# Altium schematic sheet 1_POWER.schdoc
size 302 x 215 mm; Symbol: Sheet_A4; Device: Sheet_A4; @Project Name: Yuzuki Chameleon 基于H616的卡片电脑; REV: 1.0; Date: 2021-09-08; Sheet: 1/1; Draw By: GloomyGhost; Company: YuzukiHD; Version: 1.0; @Page No: 1; @Page Count: 4; @Update Date: 2025-03-02; SheetNumber: 1; SheetTotal: 4
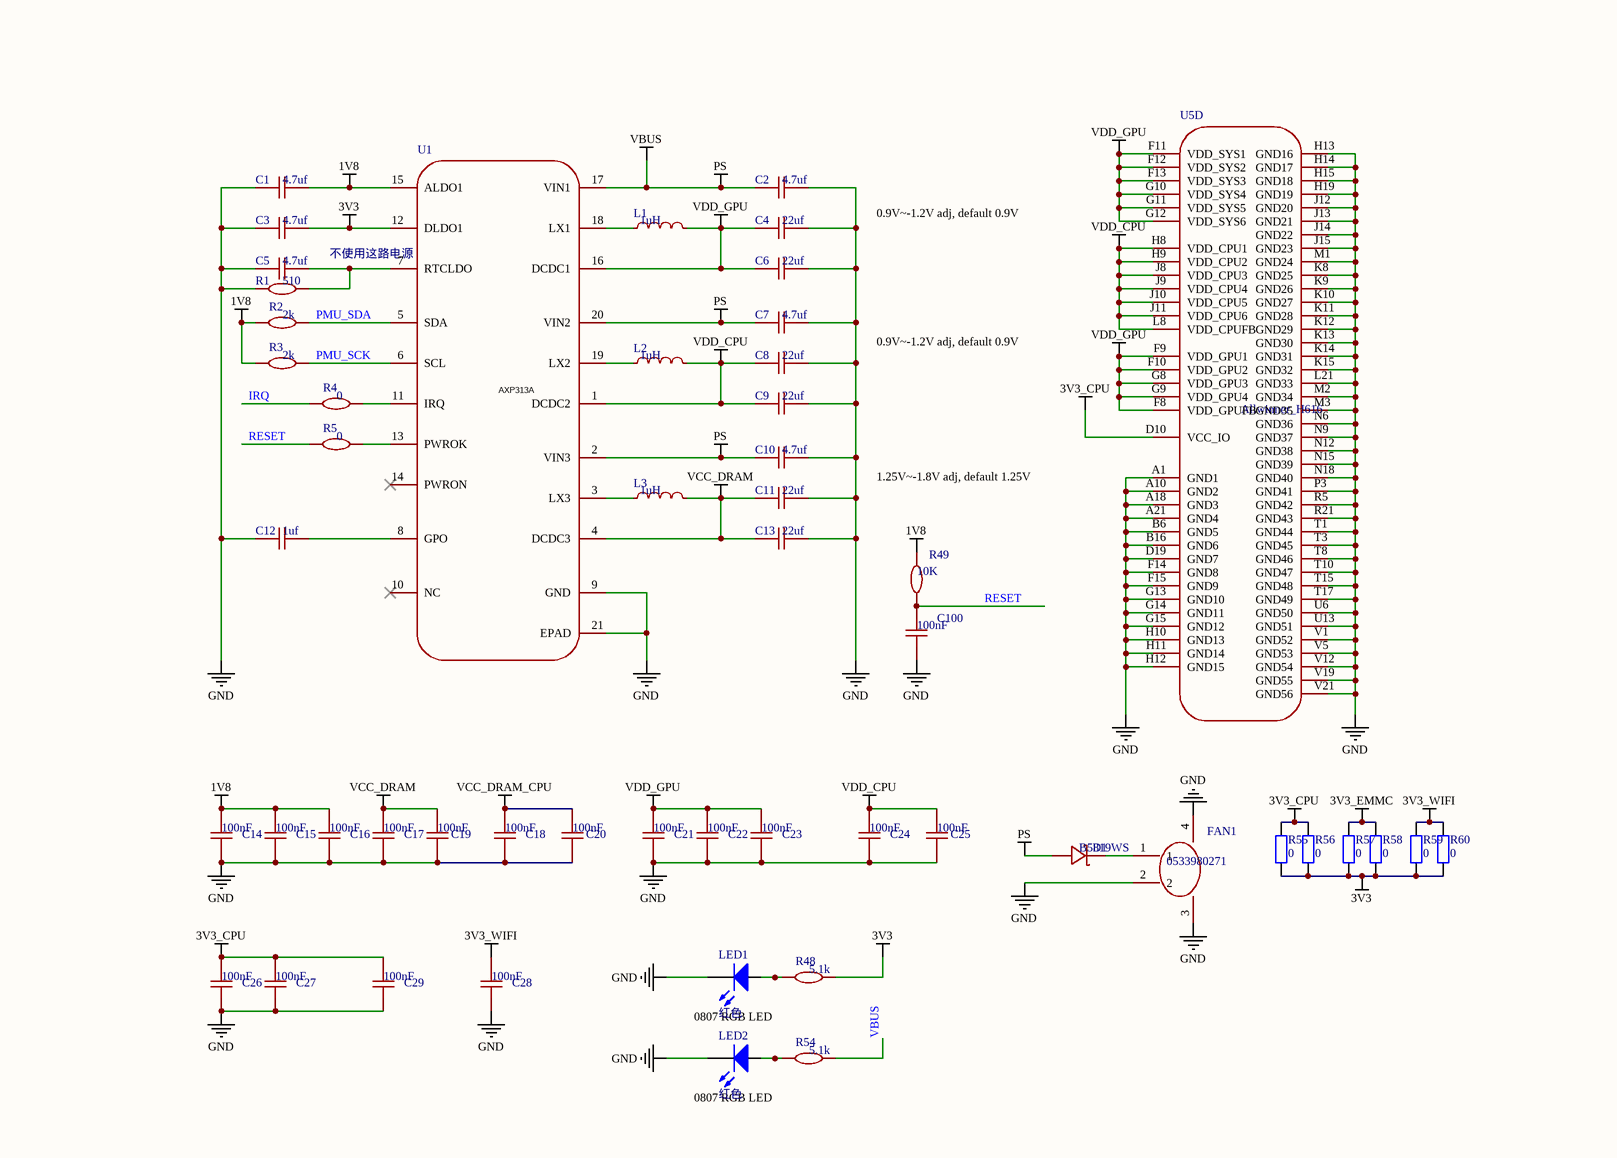
[diagram p0: 1_POWER.schdoc]

## Parts
C1  4.7uf  [C0402]
C2  4.7uf  [C0603]
C3  4.7uf  [C0402]
C4  22uf  [C0603]
C5  4.7uf  [C0402]
C6  22uf  [C0603]
C7  4.7uf  [C0603]
C8  22uf  [C0603]
C9  22uf  [C0603]
C10  4.7uf  [C0603]
C11  22uf  [C0603]
C12  1uf  [C0402]
C13  22uf  [C0603]
C14  100nF  [C0402-NSK]
C15  100nF  [C0402-NSK]
C16  100nF  [C0402-NSK]
C17  100nF  [C0402-NSK]
C18  100nF  [C0402-NSK]
C19  100nF  [C0402-NSK]
C20  100nF  [C0402-NSK]
C21  100nF  [C0402-NSK]
C22  100nF  [C0402-NSK]
C23  100nF  [C0402-NSK]
C24  100nF  [C0402-NSK]
C25  100nF  [C0402-NSK]
C26  100nF  [C0402-NSK]
C27  100nF  [C0402-NSK]
C28  100nF  [C0402-NSK]
C29  100nF  [C0402-NSK]
C100  100nF  [C0402]
D1  B5819WS  [SOD-323_L1.8-W1.3-LS2.5-NSK]
FAN1  0533980271  [CONN-SMD_2P-P1.25_053398-0X71]
L1  1uH  [IND-SMD_L2.0-W1.6_1]
L2  1uH  [IND-SMD_L2.0-W1.6_1]
L3  1uH  [IND-SMD_L2.0-W1.6_1]
LED1  红色  [LED0805_G]
LED2  红色  [LED0805_G]
R1  510  [R0402-NSK_2]
R2  2k  [R0402-NSK_2]
R3  2k  [R0402-NSK_2]
R4  0  [R0402-NSK_2]
R5  0  [R0402-NSK_2]
R48  5.1k  [R0402-NSK_2]
R49  10K  [R0402-NSK_2]
R54  5.1k  [R0402-NSK_2]
R55  0  [R0805_L]
R56  0  [R0805_L]
R57  0  [R0805_L]
R58  0  [R0805_L]
R59  0  [R0805_L]
R60  0  [R0805_L]
U1  AXP313A  [WQFN-20_L3.0-W3.0-P0.40-BL-EP]
U5  Allwinner_H616  [BGA284P65B1200_1400H125]  (part D of 4)

## Nets
1V8: C1.2 C14.2 C15.2 C16.2 R2.1 R3.1 R49.2 U1.15(ALDO1)
3V3: C3.2 R48.2 R55.1 R56.1 R57.1 R58.1 R59.1 R60.1 U1.12(DLDO1)
3V3_CPU: C26.2 C27.2 C29.2 R55.2 R56.2 U5.D10(VCC_IO)
3V3_EMMC: R57.2 R58.2
3V3_WIFI: C28.2 R59.2 R60.2
GND: C1.1 C2.2 C3.1 C4.2 C5.1 C6.2 C7.2 C8.2 C9.2 C10.2 C11.2 C12.1 C13.2 C14.1 C15.1 C16.1 C17.1 C18.1 C19.1 C20.1 C21.1 C22.1 C23.1 C24.1 C25.1 C26.1 C27.1 C28.1 C29.1 C100.1 FAN1.2 FAN1.3 FAN1.4 LED1.2(K) LED2.2(K) R1.1 U1.9(GND) U1.21(EPAD) U5.A1(GND1) U5.A10(GND2) U5.A18(GND3) U5.A21(GND4) U5.B6(GND5) U5.B16(GND6) U5.D19(GND7) U5.F14(GND8) U5.F15(GND9) U5.G13(GND10) U5.G14(GND11) U5.G15(GND12) U5.H10(GND13) U5.H11(GND14) U5.H12(GND15) U5.H13(GND16) U5.H14(GND17) U5.H15(GND18) U5.H19(GND19) U5.J12(GND20) U5.J13(GND21) U5.J14(GND22) U5.J15(GND23) U5.K8(GND25) U5.K9(GND26) U5.K10(GND27) U5.K11(GND28) U5.K12(GND29) U5.K13(GND30) U5.K14(GND31) U5.K15(GND32) U5.L21(GND33) U5.M1(GND24) U5.M2(GND34) U5.M3(GND35) U5.N6(GND36) U5.N9(GND37) U5.N12(GND38) U5.N15(GND39) U5.N18(GND40) U5.P3(GND41) U5.R5(GND42) U5.R21(GND43) U5.T1(GND44) U5.T3(GND45) U5.T8(GND46) U5.T10(GND47) U5.T15(GND48) U5.T17(GND49) U5.U6(GND50) U5.U13(GND51) U5.V1(GND52) U5.V5(GND53) U5.V12(GND54) U5.V19(GND55) U5.V21(GND56)
VBUS: C2.1 C7.1 C10.1 D1.2(A) R54.2 U1.2(VIN3) U1.17(VIN1) U1.20(VIN2)  [also labelled PS]
VCC_DRAM: C11.1 C13.1 C17.2 C19.2 L3.2 U1.4(DCDC3)
VCC_DRAM_CPU: C18.2 C20.2
VDD_CPU: C8.1 C9.1 C24.2 C25.2 L2.2 U1.1(DCDC2) U5.H8(VDD_CPU1) U5.H9(VDD_CPU2) U5.J8(VDD_CPU3) U5.J9(VDD_CPU4) U5.J10(VDD_CPU5) U5.J11(VDD_CPU6) U5.L8(VDD_CPUFB)
VDD_GPU: C4.1 C6.1 C21.2 C22.2 C23.2 L1.2 U1.16(DCDC1) U5.F8(VDD_GPUFB) U5.F9(VDD_GPU1) U5.F10(VDD_GPU2) U5.F11(VDD_SYS1) U5.F12(VDD_SYS2) U5.F13(VDD_SYS3) U5.G8(VDD_GPU3) U5.G9(VDD_GPU4) U5.G10(VDD_SYS4) U5.G11(VDD_SYS5) U5.G12(VDD_SYS6)
IRQ: R4.1
PMU_SCK: R3.2 U1.6(SCL)
PMU_SDA: R2.2 U1.5(SDA)
RESET: C100.2 R5.1 R49.1
NetC5_2: C5.2 R1.2 U1.7(RTCLDO)
NetC12_2: C12.2 U1.8(GPO)
NetD1_1: D1.1(K) FAN1.1
NetL1_1: L1.1 U1.18(LX1)
NetL2_1: L2.1 U1.19(LX2)
NetL3_1: L3.1 U1.3(LX3)
NetLED1_1: LED1.1(A) R48.1
NetLED2_1: LED2.1(A) R54.1
NetR4_2: R4.2 U1.11(IRQ)
NetR5_2: R5.2 U1.13(PWROK)

Not connected (* = marked no-connect by the designer): U1 10(NC)* 14(PWRON)*

## Notes on the sheet
- 0.9V~-1.2V adj, default 0.9V
- 不使用这路电源
- 1.25V~-1.8V adj, default 1.25V
- 0807 RGB LED
- 1
- 2
- 3
- 4
- 5
- A
- B
- C
- D
- TITLE:
- Yuzuki Chameleon 基于H616的卡片电脑
- REV:
- 1.0
- Company:
- Date:
- 2021-09-08
- YuzukiHD
- Drawn By:
- GloomyGhost
- Sheet:
- 1/1

## Library data of the parts
C1 C3 C5 C12 C14-C29 C100 = CAP_0402
C2 C4 C6-C11 C13 = CAP_0603
L1-L3 = CKCS201610-2.2uH/M_2
LED1 LED2 = LED: 贴片LED
R1-R5 R48 R49 R54 = Res_0402
R55-R60 = R: 贴片电阻
U1 = AXP1530